# EAGLE design control_board (EAGLE 9.5.2)
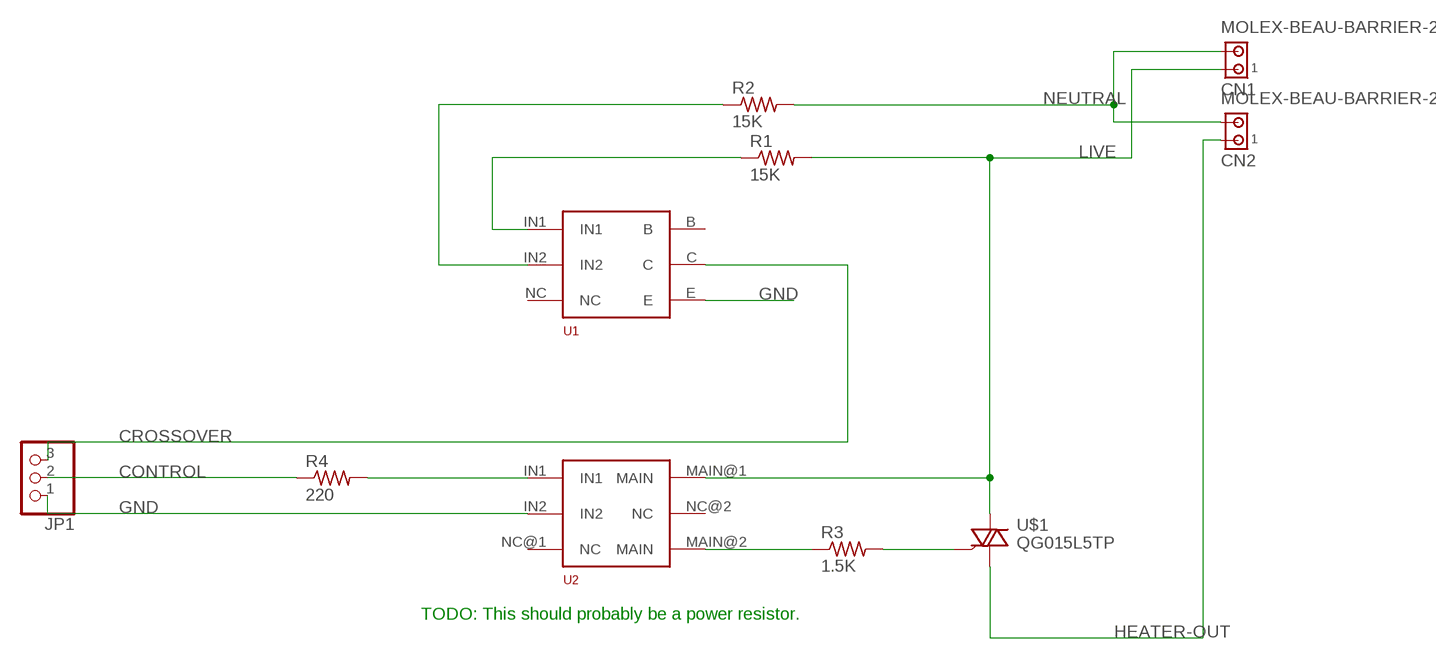
[diagram p0: schematic, sheet 1]

## Parts
CN1  MOLEX-BEAU-BARRIER-2  [MOLEX-BEAU-BARRIER-2]
CN2  MOLEX-BEAU-BARRIER-2  [MOLEX-BEAU-BARRIER-2]
JP1  PINHD-1X3/90  [1X03/90]
R1  15K  RSF100JB-73  [RSF100]
R2  15K  RSF100JB-73  [RSF100]
R3  1.5K  YAGEO_CFR  [CR-25]
R4  220  YAGEO_CFR  [CR-25]
U1  H11AA4M  [H11AA4M]
U2  MOC3052M  [MOC3052M]
U$1  QG015L5TP  [QG015L5TP]

## Nets
CONTROL: JP1.2 R4.P$1
CROSSOVER: JP1.3 U1.C
GND: JP1.1 U1.E U2.IN2
HEATER-OUT [Power]: CN2.P1 U$1.P$1(A1)
LIVE [Power]: CN1.P1 R1.P$2 U2.MAIN@1(MAIN) U$1.P$3(A2)
N$1 [Power]: R2.P$1 U1.IN2
N$2 [Power]: R1.P$1 U1.IN1
N$5 [Power]: R3.P$1 U2.MAIN@2(MAIN)
N$6 [Power]: R3.P$2 U$1.P$2(G)
N$7: R4.P$2 U2.IN1
NEUTRAL [Power]: CN1.P2 CN2.P2 R2.P$2
Unconnected: U1.B U1.NC U2.NC@1(NC) U2.NC@2(NC)

## Notes on the sheet
- TODO: This should probably be a power resistor.

## Library data of the parts
CN1 CN2 = ref_lib:MOLEX-BEAU-BARRIER-2
JP1 = pinhead:PINHD-1X3: PIN HEADER
R1 R2 = ref_lib:RSF100JB-73: Yageo RSF Flame-Proof Type, Metal Oxide Film
R3 R4 = ref_lib:YAGEO_CFR
U1 = thermo:H11AA4M: AC Input Phototransistor Optocoupler
U2 = thermo:MOC3052M
U$1 = ref_lib:QG015L5TP

## Net classes
1 Power: width 1.245 mm, clearance 0.762 mm

## Board
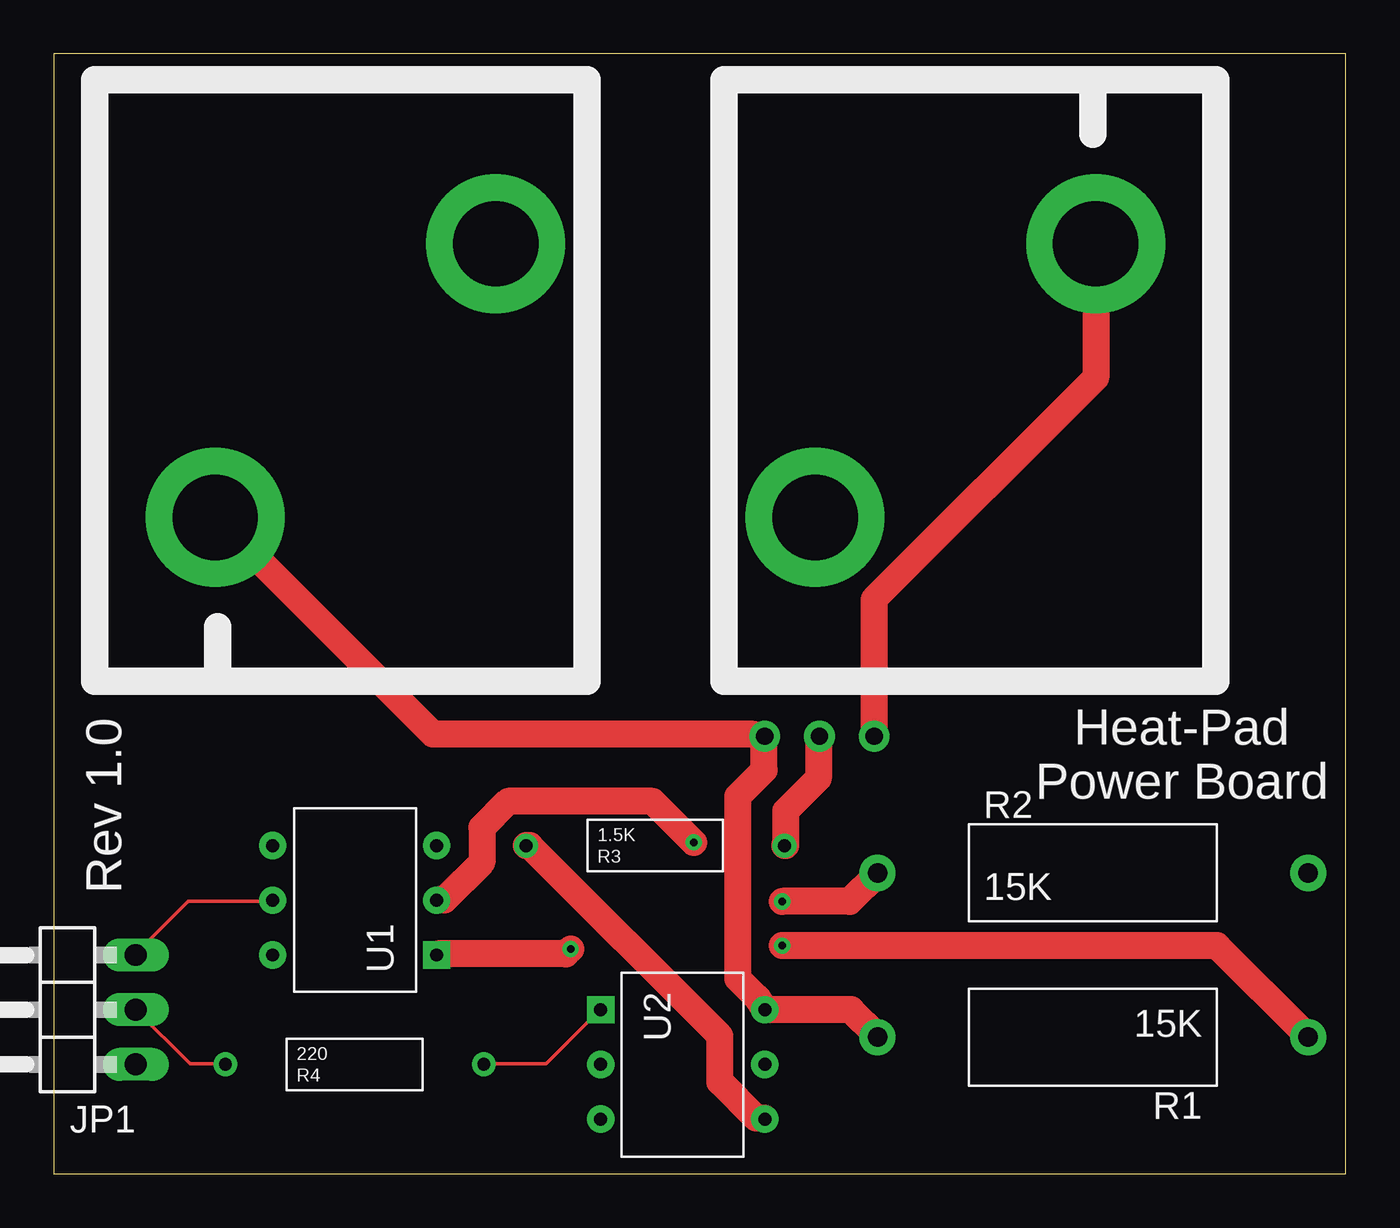
[diagram p1: board, top side]
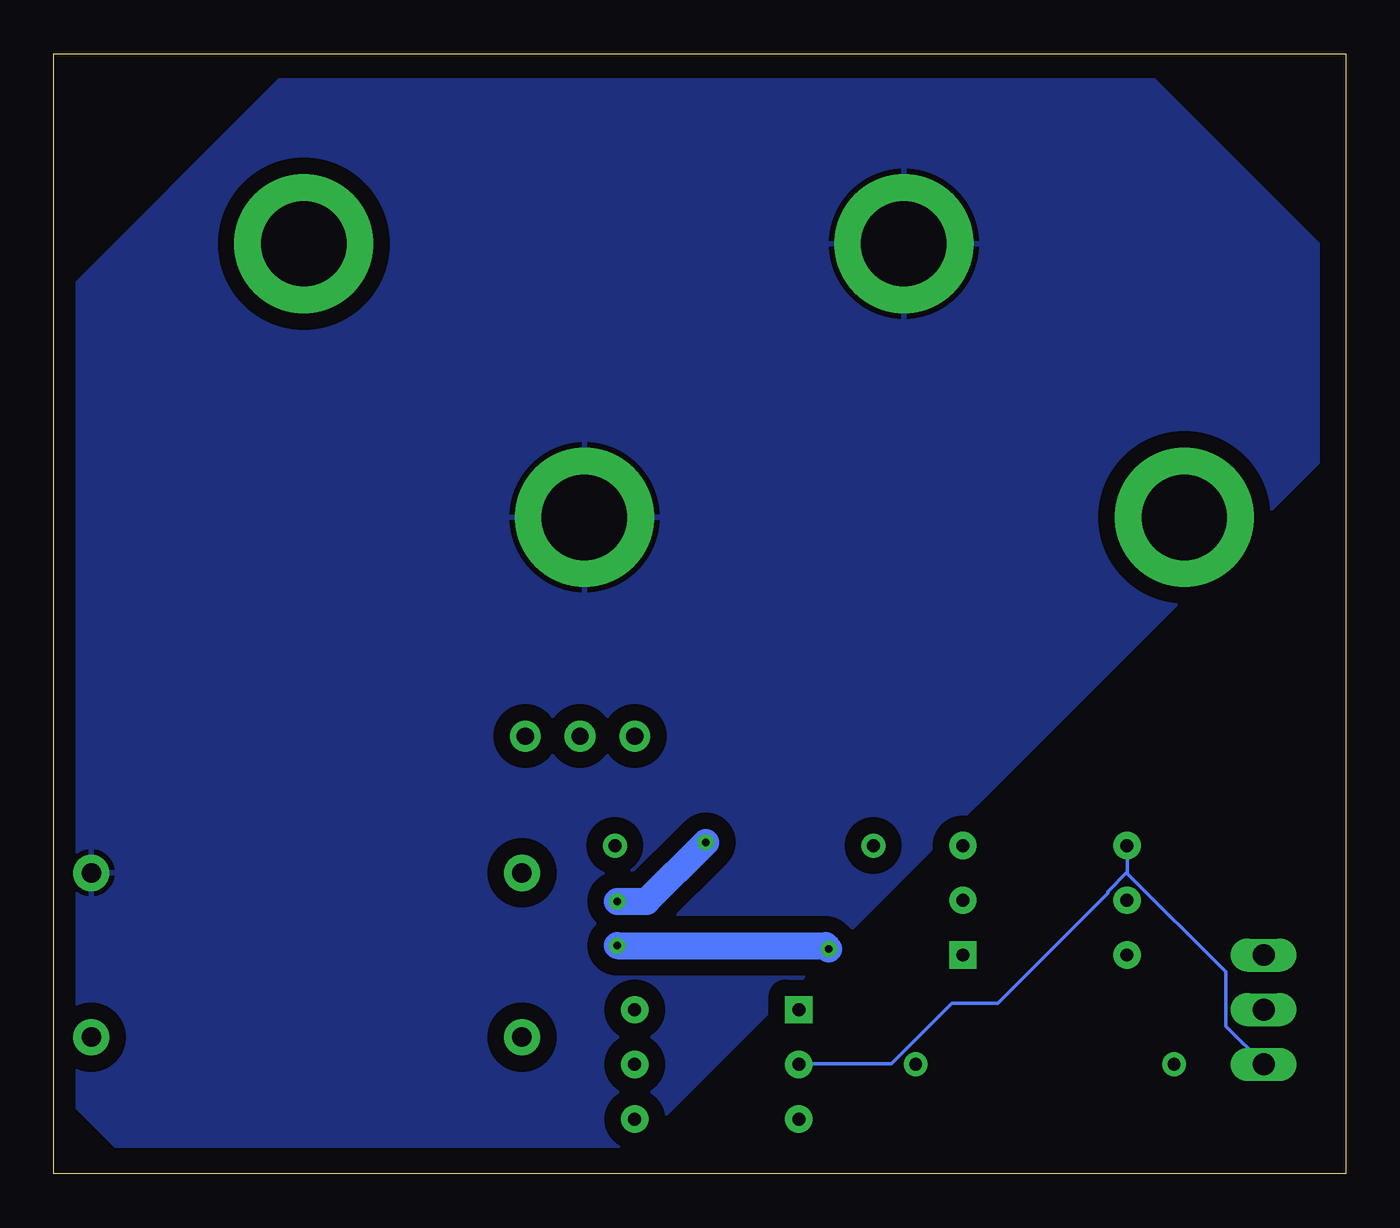
[diagram p2: board, bottom side, seen from below]

Size 60 x 52 mm. Coordinates in mm from the lower left corner, seen from the top.
Outline: 0,0 60,0 60,52 0,52 0,0
Copper layers (1*16): Top 0.035mm / dielectric 1.5mm / Bottom 0.035mm
Design rules "default": minimum track width 6mil, minimum drill 0.35mm, track to track 6mil, track to pad 6mil, pad to pad 6mil, via to via 6mil, smd to smd 6mil, copper to edge 40mil, drill to drill 6mil, minimum pad ring 10mil, minimum via ring 8mil, stop-mask expansion 4mil, vias tented up to drill 0mil, thermal gap 10mil

### Footprints (pad centres in the part's own frame; a part is rotated, then mirrored left to right if it is on the bottom)
MOLEX-BEAU-BARRIER-2 = drill 3.962 pad 6.452: P1 6.35,-5.207; P2 -6.35,7.823
1X03/90 = drill 1.016 long: 1 -2.54,-3.81; 2 0,-3.81; 3 2.54,-3.81
RSF100 = drill 0.9 pad 1.676: P$1 -10,0; P$2 10,0
CR-25 = drill 0.6: P$1 -6,0; P$2 6,0
H11AA4M = drill 0.6 pad 1.27: B -2.54,3.81; C 0,3.81; E 2.54,3.81; IN2 0,-3.81; NC 2.54,-3.81 | drill 0.6 pad 1.27 square: IN1 -2.54,-3.81
MOC3052M = drill 0.6 pad 1.27 square: IN1 -2.54,-3.81 | drill 0.6 pad 1.27: IN2 0,-3.81; MAIN@1 -2.54,3.81; MAIN@2 2.54,3.81; NC@1 2.54,-3.81; NC@2 0,3.81
QG015L5TP = drill 0.8 pad 1.422: P$1 2.54,0; P$2 0,0; P$3 -2.54,0

### Placement (x,y rotation side)
CN1  12.7,36.83 270 top
CN2  43.18,36.83 90 top
JP1  0,7.62 90 top
R1  48.26,6.35 180 top
R2  48.26,13.97 0 top
R3  27.94,15.24 0 top
R4  13.97,5.08 0 top
U1  13.97,12.7 90 top
U2  29.21,5.08 270 top
U$1  35.56,20.32 0 top

### Tracks (layer width: path | path; a pad name or v marks a point on that pad's centre or on a via)
CONTROL
  Top 0.152: JP1.2 6.33,5.11 7.92,5.11 R4.P$1
CROSSOVER
  Top 0.152: U1.C 10.13,12.65 6.25,12.65 3.81,10.21 JP1.3
GND
  Bottom 0.152: 10.13,14.02 10.13,13.95 5.56,9.37 5.56,6.86 3.81,5.11 JP1.1 | 10.13,14.02 10.13,15.24 U1.E | 10.13,14.02 11.05,13.11 11.05,13.03 16.15,7.92 18.29,7.92 21.11,5.11 25.38,5.11 U2.IN2
HEATER-OUT
  Top 1.245: U$1.P$1 38.1,26.67 48.39,36.96 CN2.P1
LIVE
  Top 1.245: R1.P$2 38.25,6.4 37.03,7.62 U2.MAIN@1 32.69,8.15 31.77,9.07 31.77,17.53 32.99,18.75 32.99,20.27 U$1.P$3 32.38,20.42 17.6,20.42 7.54,30.48 CN1.P1
N$1  (via drill 0.35)
  Top 1.245: v29.72,15.39 27.81,17.3 21.11,17.3 19.89,16.08 19.89,14.48 18.14,12.72 17.83,12.72 U1.IN2 | v33.83,12.65 36.96,12.65 38.25,13.95 R2.P$1
  Bottom 1.245: v29.72,15.39 32.46,12.65 v33.83,12.65
N$2  (via drill 0.35)
  Top 1.245: v24,10.44 23.77,10.21 17.83,10.21 U1.IN1 | v33.83,10.59 54.03,10.59 58.22,6.4 R1.P$1
  Bottom 1.245: v24,10.44 24.16,10.59 v33.83,10.59
N$5
  Top 1.245: R3.P$1 22.1,15.24 30.94,6.4 30.94,4.27 32.61,2.59 32.99,2.59 U2.MAIN@2
N$6
  Top 1.245: R3.P$2 33.98,15.24 33.98,16.84 35.51,18.36 35.51,20.27 U$1.P$2
N$7
  Top 0.152: R4.P$2 20.04,5.11 22.86,5.11 25.38,7.62 U2.IN1
NEUTRAL
  pour Bottom: 8.89,50.8 1.27,43.18 1.27,33.02 33.02,1.27 57.15,1.27 59.69,3.81 59.69,40.64 49.53,50.8

### Text on the board
tPlace: Heat-Pad / Power Board | Rev 1.0